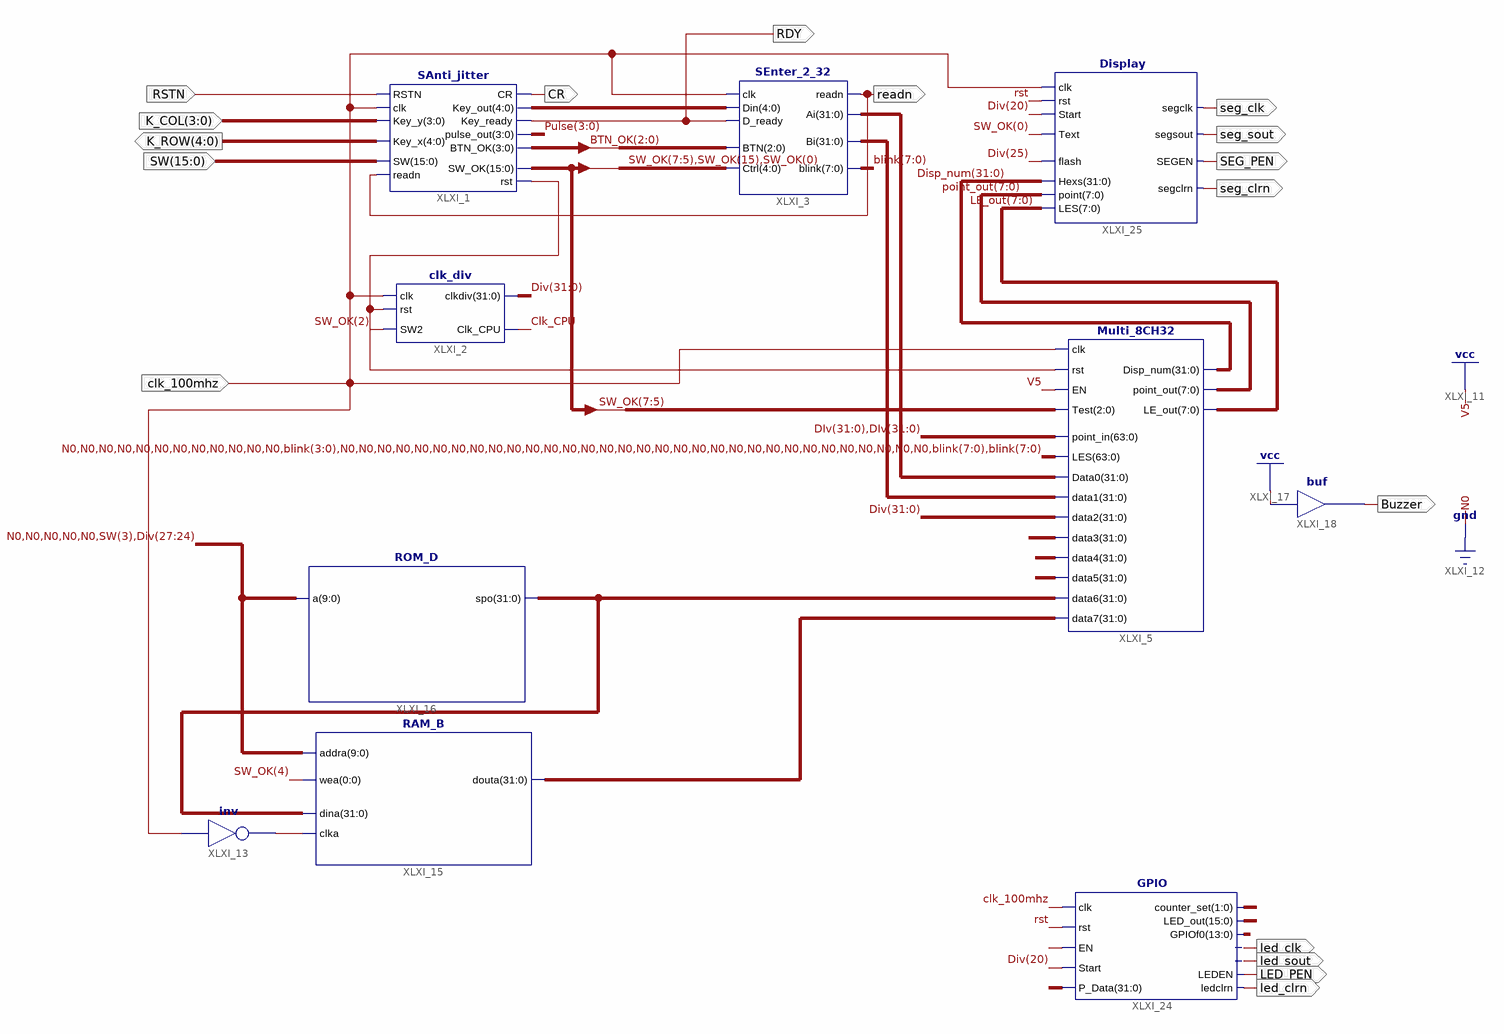
[diagram p0: schematic sheet 1]
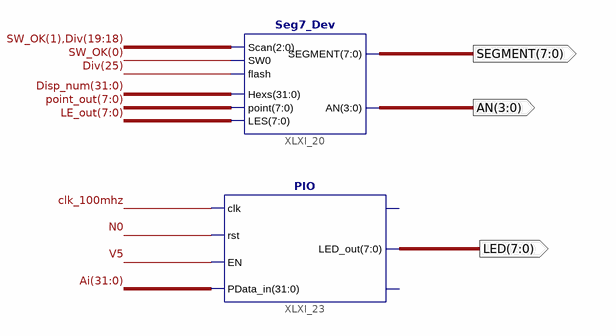
[diagram p1: schematic sheet 2]
// Xilinx ISE schematic Top.sch (kintex7) as structural Verilog: 12 symbols, 20 ports
module Top (
  input  RSTN,
  input  [3:0] K_COL,
  input  [15:0] SW,
  input  clk_100mhz,
  output [4:0] K_ROW,
  output CR,
  output RDY,
  output readn,
  output seg_clk,
  output seg_sout,
  output SEG_PEN,
  output seg_clrn,
  output led_clk,
  output led_sout,
  output LED_PEN,
  output led_clrn,
  output Buzzer,
  output [7:0] SEGMENT,
  output [3:0] AN,
  output [7:0] LED
);

  wire Clk_CPU, rst, XLXN_58, XLXN_69, XLXN_78;
  wire [1:0] XLXN_81;
  wire [3:0] BTN_OK, Pulse;
  wire [4:0] XLXN_9;
  wire [7:0] blink, LE_out, point_out;
  wire [13:0] XLXN_79;
  wire [15:0] SW_OK, XLXN_80;
  wire [31:0] Ai, Bi, Disp_num, Div, XLXN_52, XLXN_53, XLXN_77, XLXN_82, XLXN_83, XLXN_84;

  SAnti_jitter XLXI_1 (
    .SW(SW), .readn(readn), .Key_y(K_COL), .Key_x(K_ROW), .RSTN(RSTN), .clk(clk_100mhz), .Key_out(XLXN_9),
    .Key_ready(RDY), .CR(CR), .rst(XLXN_69), .SW_OK(SW_OK), .pulse_out(Pulse), .BTN_OK(BTN_OK));
  clk_div XLXI_2 (.rst(XLXN_69), .clk(clk_100mhz), .SW2(SW_OK[2]), .clkdiv(Div), .Clk_CPU(Clk_CPU));
  Multi_8CH32 XLXI_5 (
    .Test(SW_OK[7:5]), .point_in({Div, Div}), .EN(1'b1), .clk(clk_100mhz), .rst(XLXN_69),
    .LES({{12{1'b0}}, blink[3:0], {32{1'b0}}, blink, blink}), .Data0(Ai), .data1(Bi), .data2(Div),
    .data3(XLXN_82), .data4(XLXN_83), .data5(XLXN_84), .data6(XLXN_52), .data7(XLXN_53),
    .point_out(point_out), .LE_out(LE_out), .Disp_num(Disp_num));
  SEnter_2_32 XLXI_3 (
    .readn(readn), .Ai(Ai), .Bi(Bi), .blink(blink), .Din(XLXN_9), .D_ready(RDY), .clk(clk_100mhz),
    .Ctrl({SW_OK[7:5], SW_OK[15], SW_OK[0]}), .BTN(BTN_OK[2:0]));
  not XLXI_13 (XLXN_58, clk_100mhz);
  RAM_B XLXI_15 (
    .addra({{5{1'b0}}, SW[3], Div[27:24]}), .clka(XLXN_58), .wea(SW_OK[4]), .dina(XLXN_52), .douta(XLXN_53));
  ROM_D XLXI_16 (.a({{5{1'b0}}, SW[3], Div[27:24]}), .spo(XLXN_52));
  buf XLXI_18 (Buzzer, 1'b1);
  Seg7_Dev XLXI_20 (
    .LES(LE_out), .Scan({SW_OK[1], Div[19:18]}), .SEGMENT(SEGMENT), .AN(AN), .point(point_out),
    .flash(Div[25]), .SW0(SW_OK[0]), .Hexs(Disp_num));
  PIO XLXI_23 (.clk(clk_100mhz), .rst(1'b0), .EN(1'b1), .PData_in(Ai), .LED_out(LED));  // open: GPIOf0, counter_set
  GPIO XLXI_24 (
    .clk(clk_100mhz), .P_Data(XLXN_77), .rst(rst), .EN(XLXN_78), .Start(Div[20]), .ledclk(led_clk),
    .GPIOf0(XLXN_79), .LED_out(XLXN_80), .counter_set(XLXN_81), .ledclrn(led_clrn), .LEDEN(LED_PEN),
    .ledsout(led_sout));
  Display XLXI_25 (
    .LES(LE_out), .SEGEN(SEG_PEN), .segsout(seg_sout), .segclrn(seg_clrn), .point(point_out),
    .Hexs(Disp_num), .Text(SW_OK[0]), .flash(Div[25]), .segclk(seg_clk), .clk(clk_100mhz), .rst(rst),
    .Start(Div[20]));
endmodule
